# EAGLE schematic weko (EAGLE 6.5.0)
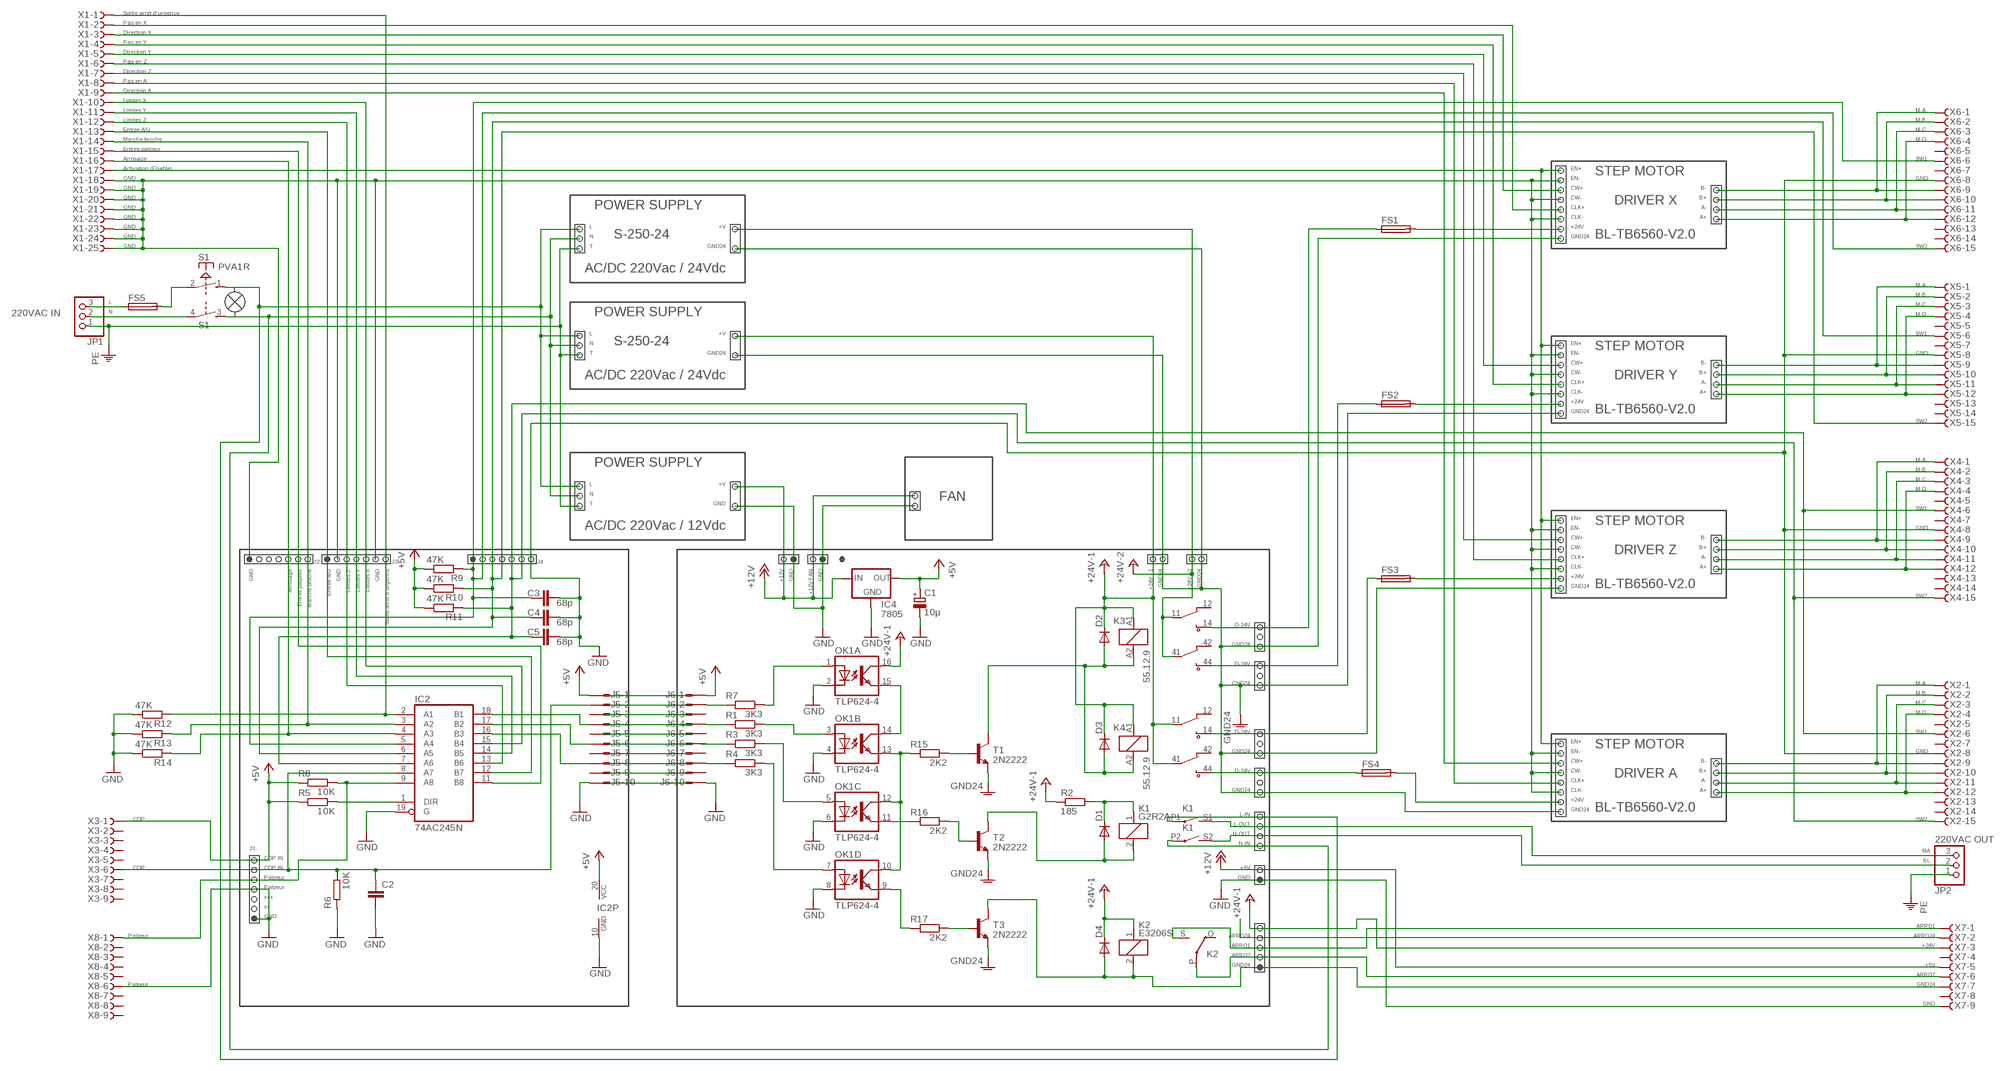
[diagram p0: schematic, sheet 1]

## Parts
C1  10µ  CPOL-EUE2-4  [E2-4]
C2  C-EU050-030X075  [C050-030X075]
C3  68p  C-EU050-030X075  [C050-030X075]
C4  68p  C-EU050-030X075  [C050-030X075]
C5  68p  C-EU050-030X075  [C050-030X075]
D1  1N4148DO35-10  [DO35-10]
D2  1N4148DO35-10  [DO35-10]
D3  1N4148DO35-10  [DO35-10]
D4  1N4148DO35-10  [DO35-10]
FS1  KS10H  [KS10H]
FS2  KS10H  [KS10H]
FS3  KS10H  [KS10H]
FS4  KS10H  [KS10H]
FS5  KS10H  [KS10H]
IC2  74AC245N  [DIL20]
IC4  7805  78MXXS  [78MXXS]
J5  10HS  [10H]
J6  10HS  [10H]
JP1  PINHD-1X03_2.00  [1X03M]
JP2  PINHD-1X03_2.00  [1X03M]
K1  G2R2A  [G2R2A]
K2  E3206S  [E3206S]
K3  55.12.9  55.12.8  [55.12]
K4  55.12.9  55.12.8  [55.12]
OK1  TLP624-4  TLP283-4  [MINI-FLAT-16]
R1  3K3  R-EU_0411/12  [0411/12]
R2  185  R-EU_0411/12  [0411/12]
R3  3K3  R-EU_0411/12  [0411/12]
R4  3K3  R-EU_0411/12  [0411/12]
R5  10K  R-EU_0411/12  [0411/12]
R6  10K  R-EU_0411/12  [0411/12]
R7  3K3  R-EU_0411/12  [0411/12]
R8  10K  R-EU_0411/12  [0411/12]
R9  47K  R-EU_0411/12  [0411/12]
R10  47K  R-EU_0411/12  [0411/12]
R11  47K  R-EU_0411/12  [0411/12]
R12  47K  R-EU_0411/12  [0411/12]
R13  47K  R-EU_0411/12  [0411/12]
R14  47K  R-EU_0411/12  [0411/12]
R15  2K2  R-EU_0411/12  [0411/12]
R16  2K2  R-EU_0411/12  [0411/12]
R17  2K2  R-EU_0411/12  [0411/12]
S1  PVA1R  [PVA1R]
T1  2N2222  [TO18]
T2  2N2222  [TO18]
T3  2N2222  [TO18]
X1  F25VBS  [F25VB]
X2  F15VBS  [F15VB]
X3  F09VBS  [F09VB]
X4  F15VBS  [F15VB]
X5  F15VBS  [F15VB]
X6  F15VBS  [F15VB]
X7  F09VBS  [F09VB]
X8  F09VBS  [F09VB]

## Nets
+5V: C1.+ IC2.20(VCC) IC4.OUT J5.1 J6.1 R5.2 R8.2 R9.1 R10.1 R11.1 X3.1
+12V: IC4.IN X7.5
+24V: D2.C D3.C D4.C K2.1 K3.11 K3.41 K3.A1 K4.11 K4.41 K4.A1 OK1.16(A:COL) R2.1 X7.3 ; supply symbol labelled +24V-2, +24V-1
AGND: T1.1(E) T2.1(E) T3.1(E) ; supply symbol labelled GND24
GND: C1.- C2.2 C3.2 C4.2 C5.2 IC2.10(GND) IC2.19(G) IC4.GND J5.10 J6.10 OK1.2(A:C) OK1.4(B:C) OK1.6(C:C) OK1.8(D:C) R6.2 R12.1 R13.1 R14.1 X2.8 X4.8 X5.8 X6.8 X7.9 X8.6
N$1: OK1.5(C:A) R3.1
N$3: OK1.3(B:A) R1.1
N$4: K1.P2(3:P) S1.3(2:S)
N$5: OK1.9(D:EMIT) R17.2
N$6: X7.2
N$7: FS5.1 JP1.3
N$8: IC2.18(B1) J5.4
N$9: R3.2
N$10: J6.8 R4.2
N$11: IC2.1(DIR) R5.1
N$12: D1.C K1.1 R2.2
N$13: K2.P(2:P) X7.6
N$14: OK1.10(D:COL) OK1.12(C:COL) OK1.13(B:EMIT) R15.2
N$15: OK1.14(B:COL) OK1.15(A:EMIT)
N$16: C2.1 IC2.8(A7) J5.2 R6.1 X3.6
N$17: K2.S(2:S) X7.1
N$18: OK1.1(A:A) R7.1
N$19: IC2.16(B3) J5.8
N$20: OK1.7(D:A) R4.1
N$21: IC2.2(A1) R12.2 X1.1
N$22: IC2.15(B4) X1.10
N$23: IC2.14(B5) X1.11
N$24: IC2.13(B6) X1.12
N$25: IC2.12(B7) X1.13
N$26: IC2.3(A2) R13.2 X1.14
N$27: IC2.11(B8) X1.15
N$28: IC2.4(A3) R14.2 X1.16
N$29: K1.P1(2:P) S1.1(1:S)
N$30: C3.1 IC2.5(A4) R9.2 X6.6 X6.15
N$31: IC2.9(A8) R8.1 X8.1
N$32: C4.1 IC2.6(A5) R10.2 X5.6 X5.15
N$33: J6.2 R7.2
N$34: C5.1 IC2.7(A6) R11.2 X2.6 X2.15 X4.6 X4.15
N$35: IC2.17(B2) J5.6
N$36: J6.4 R1.2
N$37: JP1.2 S1.4(2:P)
N$38: FS4.2
N$39: JP2.3 K1.S1(2:S)
N$43: JP2.2 K1.S2(3:S)
N$47: X2.1 X2.9
N$48: X2.2 X2.10
N$49: X2.3 X2.11
N$50: X2.4 X2.12
N$52: X4.1 X4.9
N$53: X4.2 X4.10
N$54: X4.3 X4.11
N$55: X4.4 X4.12
N$56: X5.1 X5.9
N$58: X5.2 X5.10
N$59: FS5.2 S1.2(1:P)
N$60: X5.3 X5.11
N$61: X5.4 X5.12
N$64: R17.1 T3.2(B)
N$65: D4.A K2.2 T3.3(C) X7.7
N$66: D2.A D3.A K3.A2 K4.A2 T1.3(C)
N$67: X6.1 X6.9
N$68: R15.1 T1.2(B)
N$69: OK1.11(C:EMIT) R16.2
N$70: R16.1 T2.2(B)
N$71: FS3.2
N$73: D1.A K1.2 T2.3(C)
N$75: X6.2 X6.10
N$82: X6.3 X6.11
N$83: X6.4 X6.12
N$84: FS2.2
N$85: FS1.2
N$87: FS1.1 K3.14
N$88: FS2.1 K3.44
N$89: FS3.1 K4.14
N$90: FS4.1 K4.44
N$91: X1.17
N$92: X1.18 X1.19 X1.20 X1.21 X1.22 X1.23 X1.24 X1.25
N$93: X1.5
N$94: X1.2
N$95: X1.3
N$96: X1.4
N$98: X1.6
N$101: X1.7
N$102: X1.8
N$103: X1.9
PE: JP1.1 JP2.1
Unconnected: J5.3 J5.5 J5.7 J5.9 J6.3 J6.5 J6.6 J6.7 J6.9 K2.O(2:O) K3.12 K3.42 K4.12 K4.42 X2.5 X2.7 X2.13 X2.14 X3.2 X3.3 X3.4 X3.5 X3.7 X3.8 X3.9 X4.5 X4.7 X4.13 X4.14 X5.5 X5.7 X5.13 X5.14 X6.5 X6.7 X6.13 X6.14 X7.4 X7.8 X8.2 X8.3 X8.4 X8.5 X8.7 X8.8 X8.9

## Notes on the sheet
- Sortie arret d'urgence
- Pas en X
- Direction X
- Pas en Y
- Direction Y
- Pas en Z
- Direction Z
- Pas en A
- Direction A
- Limites X
- Limites Y | M-A
- Limites Z | M-B
- Entree A/U | M-C
- Marche broche | M-D
- Entree palpeur
- Arrosage | SW1
- Activation (Enable) | EN+
- STEP MOTOR
- GND | EN- | GND
- GND | CW+ | B-
- GND | CW- | B+
- DRIVER X
- GND | POWER SUPPLY | CLK+ | A-
- GND | CLK- | A+
- GND | L | +V | +24V
- GND | N | S-250-24 | GND24 | BL-TB6560-V2.0
- GND | T | GND24 | SW2
- AC/DC 220Vac / 24Vdc
- M-A
- M-B
- L
- M-C
- N
- 220VAC IN | POWER SUPPLY | M-D
- L | +V | SW1
- N | S-250-24 | EN+
- STEP MOTOR
- T | GND24 | EN- | GND
- CW+ | B-
- CW- | B+
- AC/DC 220Vac / 24Vdc | DRIVER Y
- CLK+ | A-
- CLK- | A+
- +24V
- GND24 | BL-TB6560-V2.0
- SW2
- M-A
- POWER SUPPLY
- M-B
- M-C
- L | +V
- M-D
- N
- FAN
- T | GND
- SW1
- EN+
- STEP MOTOR
- AC/DC 220Vac / 12Vdc | EN- | GND
- CW+ | B-
- CW- | B+
- DRIVER Z
- CLK+ | A-
- J2 | J3 | J4
- GND | Arrosage | Entree palpeur | Marche broche | Entree A/U | GND | Limites Z | Limites Y | Limites X | GND | Sortie arret d'urgence | +12V | GND | +12V FAN | GND | +24V - 1 | GND24 | +24V - 2 | GND24 | CLK- | A+
- +24V
- GND24 | BL-TB6560-V2.0
- SW2
- D-24V
- GND24
- D-24V
- GND24 | M-A
- M-B
- M-C
- M-D
- D-24V | SW1
- EN+
- STEP MOTOR
- GND24 | EN- | GND
- CW+ | B-
- D-24V | CW- | B+
- DRIVER A
- CLK+ | A-
- GND24 | CLK- | A+
- +24V
- GND24 | BL-TB6560-V2.0
- L-IN
- CDP | SW2
- L-OUT
- N-OUT | 220VAC OUT
- N-IN
- J1
- MA
- CDP IN
- BL
- CDP | CDP IN | +5V
- Palpeur | GND
- Palpeur
- xxx
- xx
- GND
- ARRO1
- Palpeur | ARRO24 | ARRO24
- ARRO1 | +24V
- ARRO2
- GND24 | +5V
- ARRO2
- Palpeur | GND24
- GND

## Library data of the parts
C1 = rcl:CPOL-EU: POLARIZED CAPACITOR, European symbol
C2-C5 = rcl:C-EU: CAPACITOR, European symbol
D1-D4 = diode:1N4148: DIODE high speed (Philips)
FS1-FS5 = fuse:KS10H: FUSE HOLDER CS, Schukat
IC2 = 74xx-eu:74*245: Octal BUS TRANSCEIVER, 3-state
IC4 = v-reg:78MXXS: VOLTAGE REGULATOR
J5 J6 = con-harting-h:10HS: CONNECTOR; OC_FARNELL: unknown; OC_NEWARK: unknown
JP1 JP2 = pinhead-2:PINHD-1X03: PIN HEADER
K1 = relay:G2R2A: RELAY 2 x norm. open, Omron; MPN: G2R-2A-DC24; OC_FARNELL: 6985269; OC_NEWARK: 36M5257
K2 = relay:E3206S: RELAY 1 x switch, Eichhoff/distributor Schukat; OC_FARNELL: unknown; OC_NEWARK: unknown
K3 K4 = relay:55.12.8: finder RELAY SERIE 55
OK1 = optocoupler:TLP283-4: TOSHIBA PHOTOCOUPLER GaAs IRED & PHOTO-TRANSISTOR Source: http://www.semicon.toshiba.co.jp/td/en/Opto/Photocoupler/en_20050928_TLP283_datasheet.pdf; OC_FARNELL: unknown; OC_NEWARK: unknown
R1-R17 = rcl:R-EU_: RESISTOR, European symbol
S1 = switch-misc:PVA1R: ITT SWITCH
T1-T3 = transistor:2N2222: NPN TRANSISTOR
X1 = con-subd:F25?S: SUB-D; OC_FARNELL: unknown; OC_NEWARK: unknown
X2 X4-X6 = con-subd:F15?S: SUB-D; OC_FARNELL: unknown; OC_NEWARK: unknown
X3 X7 X8 = con-subd:F09?S: SUB-D; OC_FARNELL: unknown; OC_NEWARK: unknown